# Altium schematic sheet LEDs.SchDoc
size A4; SheetNumber: 3; SheetTotal: 3
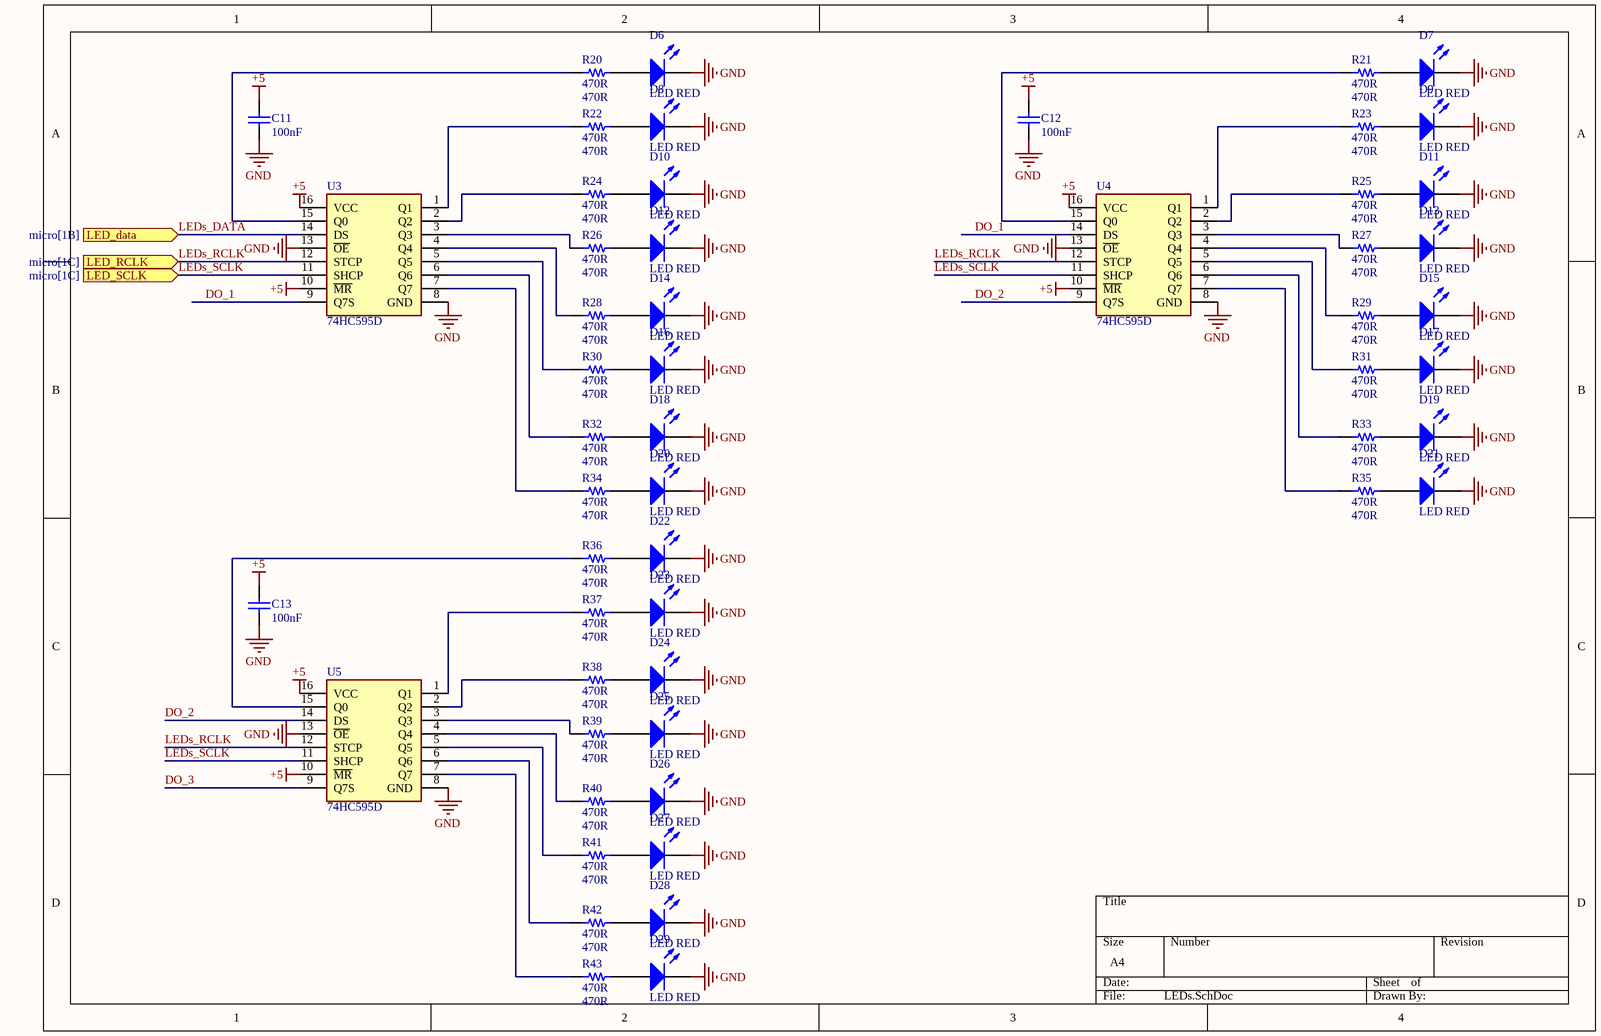
[diagram p0: LEDs.SchDoc]

## Parts
C11  100nF  [SMD_CAP_0805]
C12  100nF  [SMD_CAP_0805]
C13  100nF  [SMD_CAP_0805]
D6  LED RED  [LED_0805 G]
D7  LED RED  [LED_0805 G]
D8  LED RED  [LED_0805 G]
D9  LED RED  [LED_0805 G]
D10  LED RED  [LED_0805 G]
D11  LED RED  [LED_0805 G]
D12  LED RED  [LED_0805 G]
D13  LED RED  [LED_0805 G]
D14  LED RED  [LED_0805 G]
D15  LED RED  [LED_0805 G]
D16  LED RED  [LED_0805 G]
D17  LED RED  [LED_0805 G]
D18  LED RED  [LED_0805 G]
D19  LED RED  [LED_0805 G]
D20  LED RED  [LED_0805 G]
D21  LED RED  [LED_0805 G]
D22  LED RED  [LED_0805 G]
D23  LED RED  [LED_0805 G]
D24  LED RED  [LED_0805 G]
D25  LED RED  [LED_0805 G]
D26  LED RED  [LED_0805 G]
D27  LED RED  [LED_0805 G]
D28  LED RED  [LED_0805 G]
D29  LED RED  [LED_0805 G]
R20  470R  [RES0805]
R21  470R  [RES0805]
R22  470R  [RES0805]
R23  470R  [RES0805]
R24  470R  [RES0805]
R25  470R  [RES0805]
R26  470R  [RES0805]
R27  470R  [RES0805]
R28  470R  [RES0805]
R29  470R  [RES0805]
R30  470R  [RES0805]
R31  470R  [RES0805]
R32  470R  [RES0805]
R33  470R  [RES0805]
R34  470R  [RES0805]
R35  470R  [RES0805]
R36  470R  [RES0805]
R37  470R  [RES0805]
R38  470R  [RES0805]
R39  470R  [RES0805]
R40  470R  [RES0805]
R41  470R  [RES0805]
R42  470R  [RES0805]
R43  470R  [RES0805]
U3  74HC595D  [SOIC127P600X175-16N]
U4  74HC595D  [SOIC127P600X175-16N]
U5  74HC595D  [SOIC127P600X175-16N]

## Ports
LED_data (in, see micro[1B]), LED_RCLK (in, see micro[1C]), LED_SCLK (in, see micro[1C])

## Nets
+5: C11.2 C12.2 C13.2 U3.10(~{MR}) U3.16(VCC) U4.10(~{MR}) U4.16(VCC) U5.10(~{MR}) U5.16(VCC)
GND: C11.1 C12.1 C13.1 D6.2(K) D7.2(K) D8.2(K) D9.2(K) D10.2(K) D11.2(K) D12.2(K) D13.2(K) D14.2(K) D15.2(K) D16.2(K) D17.2(K) D18.2(K) D19.2(K) D20.2(K) D21.2(K) D22.2(K) D23.2(K) D24.2(K) D25.2(K) D26.2(K) D27.2(K) D28.2(K) D29.2(K) U3.8(GND) U3.13(~{OE}) U4.8(GND) U4.13(~{OE}) U5.8(GND) U5.13(~{OE})
DO_1: U3.9(Q7S) U4.14(DS)
DO_2: U4.9(Q7S) U5.14(DS)
DO_3: U5.9(Q7S)
LEDs_DATA: U3.14(DS) ; port LED_data
LEDs_RCLK: U3.12(STCP) U4.12(STCP) U5.12(STCP) ; port LED_RCLK
LEDs_SCLK: U3.11(SHCP) U4.11(SHCP) U5.11(SHCP) ; port LED_SCLK
NetD6_1: D6.1(A) R20.1
NetD7_1: D7.1(A) R21.1
NetD8_1: D8.1(A) R22.1
NetD9_1: D9.1(A) R23.1
NetD10_1: D10.1(A) R24.1
NetD11_1: D11.1(A) R25.1
NetD12_1: D12.1(A) R26.1
NetD13_1: D13.1(A) R27.1
NetD14_1: D14.1(A) R28.1
NetD15_1: D15.1(A) R29.1
NetD16_1: D16.1(A) R30.1
NetD17_1: D17.1(A) R31.1
NetD18_1: D18.1(A) R32.1
NetD19_1: D19.1(A) R33.1
NetD20_1: D20.1(A) R34.1
NetD21_1: D21.1(A) R35.1
NetD22_1: D22.1(A) R36.1
NetD23_1: D23.1(A) R37.1
NetD24_1: D24.1(A) R38.1
NetD25_1: D25.1(A) R39.1
NetD26_1: D26.1(A) R40.1
NetD27_1: D27.1(A) R41.1
NetD28_1: D28.1(A) R42.1
NetD29_1: D29.1(A) R43.1
NetR20_2: R20.2 U3.15(Q0)
NetR21_2: R21.2 U4.15(Q0)
NetR22_2: R22.2 U3.1(Q1)
NetR23_2: R23.2 U4.1(Q1)
NetR24_2: R24.2 U3.2(Q2)
NetR25_2: R25.2 U4.2(Q2)
NetR26_2: R26.2 U3.3(Q3)
NetR27_2: R27.2 U4.3(Q3)
NetR28_2: R28.2 U3.4(Q4)
NetR29_2: R29.2 U4.4(Q4)
NetR30_2: R30.2 U3.5(Q5)
NetR31_2: R31.2 U4.5(Q5)
NetR32_2: R32.2 U3.6(Q6)
NetR33_2: R33.2 U4.6(Q6)
NetR34_2: R34.2 U3.7(Q7)
NetR35_2: R35.2 U4.7(Q7)
NetR36_2: R36.2 U5.15(Q0)
NetR37_2: R37.2 U5.1(Q1)
NetR38_2: R38.2 U5.2(Q2)
NetR39_2: R39.2 U5.3(Q3)
NetR40_2: R40.2 U5.4(Q4)
NetR41_2: R41.2 U5.5(Q5)
NetR42_2: R42.2 U5.6(Q6)
NetR43_2: R43.2 U5.7(Q7)

## Library data of the parts
C11-C13 = Cap: CAP SMD 0805; Published: 8-Jun-2000; LatestRevisionDate: 17-Jul-2002; LatestRevisionNote: Re-released for DXP Platform.; PackageReference: RAD-0.3; Publisher: Altium Limited; PackageDescription: Radial Cap, Thru-Hole; 2 Leads; 0.3 in Pin Spacing; Value: 100nF
D6-D29 = LED0: LED SMD 0805 RED; Published: 8-Jun-2000; LatestRevisionDate: 08-Jul-2005; LatestRevisionNote: Mech Layer 1 removed.; PackageReference: LED-0; Publisher: Altium Limited; PackageDescription: LED; 2 Leads
R20-R43 = Resistor: RES SMD 0603; Part Number: RCS0805100KFKEA; Value: 470R
U3-U5 = 74HC595D: 74HC595 SMD; Manufacturer_Name: Nexperia; Datasheet Link: https://componentsearchengine.com/Datasheets/2/74HC595D.pdf; Height: 1.75mm; Manufacturer_Part_Number: 74HC595D; Mouser Part Number: N/A; Mouser Price/Stock: https://www.mouser.com/Search/Refine.aspx?Keyword=N%2FA